# Altium schematic sheet 02 CONNECTION.SchDoc
size 420 x 297 mm
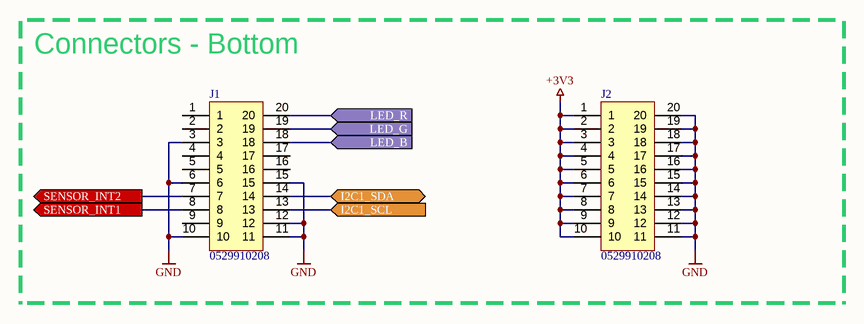
[diagram p0: 02 CONNECTION.SchDoc]

## Parts
J1  0529910208  [0529910208]
J2  0529910208  [0529910208]

## Ports
I2C1_SCL (in), I2C1_SDA (bidir), LED_B (in), LED_G (in), LED_R (in), SENSOR_INT1 (out), SENSOR_INT2 (out)

## Nets
+3V3: J2.1 J2.2 J2.3 J2.4 J2.5 J2.6 J2.7 J2.8 J2.9 J2.10
GND: J1.3 J1.6 J1.10 J1.11 J1.12 J1.15 J2.11 J2.12 J2.13 J2.14 J2.15 J2.16 J2.17 J2.18 J2.19 J2.20
I2C1_SCL: J1.13 ; port I2C1_SCL
I2C1_SDA: J1.14 ; port I2C1_SDA
LED_B: J1.18 ; port LED_B
LED_G: J1.19 ; port LED_G
LED_R: J1.20 ; port LED_R
SENSOR_INT1: J1.8 ; port SENSOR_INT1
SENSOR_INT2: J1.7 ; port SENSOR_INT2

Not connected (* = marked no-connect by the designer): J1 1 2 4 5 9 16 17

## Notes on the sheet
- Connectors - Bottom
- Title
- Project
- Size
- Date
- Revision
- A3

## Library data of the parts
J1 J2 = 0529910208: CONN PLUG 20POS SMD GOLD; manufacturer: MOLEX; mfr_part_number: 0529910208; datasheet: https://www.molex.com/pdm_docs/sd/529910208_sd.pdf